# Altium schematic sheet PWRsupply.SchDoc
size A
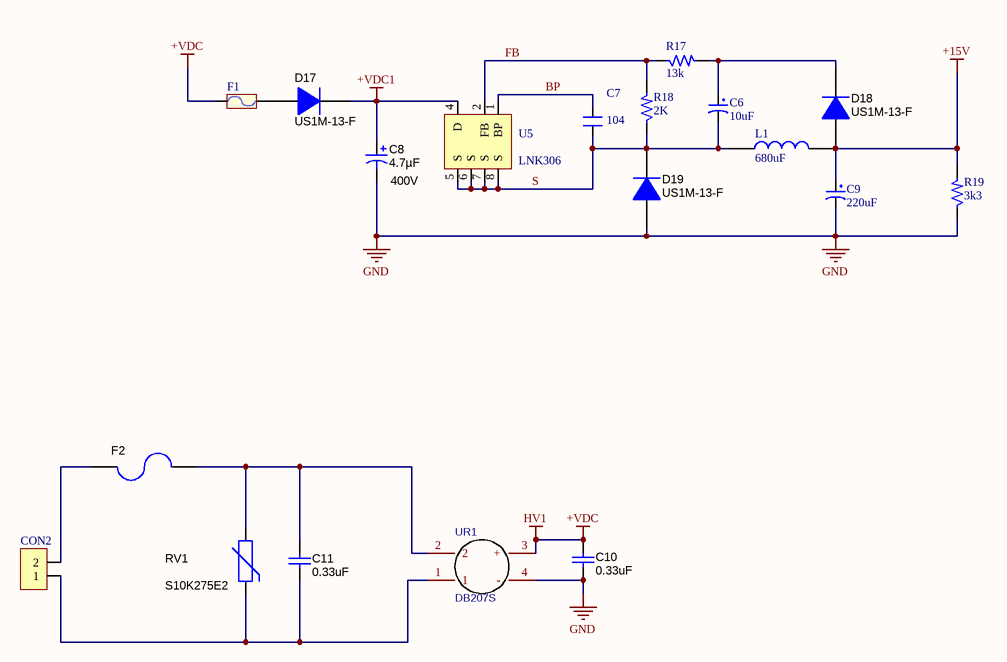
[diagram p0: PWRsupply.SchDoc]

## Parts
C6  10uF  [TU_NHOM_10uF_MH]
C7  104  [0805_Cap]
C8  ValueDisplayed: 4.7µF  Value2: 400V  [CAP-PANACAP-G-GENERIC]  (hidden comment: 400AX6R8M8x11)
C9  220uF  [TU_NHOM_2.5_MH]
C10  value 0.33uF  [B32922_12mm]  (hidden comment: B32922C3334M189)
C11  value 0.33uF  [B32922_12mm]  (hidden comment: B32922C3334M189)
CON2  CON 2 EDG 5.08_MH  [CON 2 EDG 5.08]  (value not drawn)
D17  US1M-13-F  [SMB]
D18  US1M-13-F  [SMB]
D19  US1M-13-F  [SMB]
F1  FUSE_AUTO_0.5A 8V 1206_MH  [FUSE 1206]  (value not drawn)
F2  37015000430  [Fuse 5x20]  (value not drawn)
L1  680uF  [Inductor 4.5x5]
R17  13k  [0805_R]
R18  2K  [0805_R]
R19  3k3  [0805_R]
RV1  S10K275E2  [VAR_S10K275E2]
U5  LNK306  [SOP 7]
UR1  DB207S  [DB207S]

## Nets
+15V: C9.1 D18.2(A) L1.2 R19.2
+VDC: C10.2 F1.1 UR1.3(+)  [also labelled HV1]
+VDC1: C8.1(+) D17.1(K) U5.4(D)
GND: C8.2(-) C9.2 C10.1 D19.2(A) R19.1 UR1.4(-)
BP: C7.2 U5.1(BP)
FB: R17.1 R18.2 U5.2(FB)
S: C6.2 C7.1 D19.1(K) L1.1 R18.1 U5.5(S) U5.6(S) U5.7(S) U5.8(S)
NetC6_1: C6.1 D18.1(K) R17.2
NetC11_1: C11.1 CON2.1 RV1.2 UR1.1
NetC11_2: C11.2 F2.1 RV1.1 UR1.2
NetCON2_2: CON2.2 F2.2
NetD17_2: D17.2(A) F1.2

## Library data of the parts
C6 = TU_NHOM_10uF_25V_MH: Value: 47uF/16 - 50V; Description 1: 470uF/6,3V - 330uF/10V - 220uF/16V; Description 2: 100uF/25V - 35V - 47uF/50V - 22uF/100V; Description 3: 33uF => 47uF/63V - 1uF => 4,7uF/160V; Description 4: 1uF => 2,2uF/250V - 1uF/350V
C7 = CM: Cap SMD; Value: 103
C8 = 400AX6R8M8x11: CAP, AL, 6.8uF, 400V, +/-20%, TH; Manufacturer: Rubycon; Polarized: Y; CompType: Capacitor; U/M: EA; Cap_F: 0.0000068; Tolerance_%: 20; Value1: Unknown; VDC_V: 400; TaMin_C: -40; TaMax_C: 105; Cap_Case: 8x11; SymbolVersion: 2008-07-09; Value: 6.8uF; PartNumber: 400AX6R8M8x11; PackageReference: 8x11; RoHS: Y; MountType: TH; Technology: AL; Series: AX; Publisher: Texas Instruments; LatestRevisionDate: 2013-08-02; ComponentLink1Description: Datasheet link; ComponentLink1URL: http://www.rubycon.co.jp/de/catalog/e_pdfs/aluminum/e_ax.pdf
C9 = TU_NHOM_220uF_25V_MH: LINK: https://item.taobao.com/item.htm?spm=a230r.1.14.282.6c612953FsebRk&id=546158429968&ns=1&abbucket=10#detail
C10 C11 = BFC233620154: CAP FILM 0.33UF 630VDC RADIAL; Manufacturer: EPCOS(TDK); CompType: Film Capacitor; SymbolCreator: x0199378; PartNumber: B32922C3334M189; RoHS: Y; MountType: TH; ComponentLink1Description: Datasheet link; ComponentLink1URL: http://en.tdk.eu/inf/20/20/db/fc_2009/X2_B32921_928.pdf; SymbolVersion: 2015-01-29
CON2 = CON 2 EDG 5.08_MH: CON 2 EDG 5.08 (xanh cong)
D17-D19 = MURS160-13-F: Diode, Ultrafast, 600V, 1A, SMB; Manufacturer: Diodes Inc.; U/M: EA; Vf_V: 1.25; Value2: 1.25V; Io_A: 1; Vr_V: 600; TJmax_C: 150; RJC_CperW: 13; PartNumber: US1M-13-F; CompType: Diode; SymbolVersion: 2008-12-08; MountType: SMT; RoHS: Y; Value: 600V; PackageReference: SMB; Value1: 1A; Type: Ultrafast; Published: 2008-06-26; Publisher: Texas Instruments; LatestRevisionDate: 2013-06-21; ComponentLink1Description: Datasheet link; ComponentLink1URL: http://www.diodes.com/datasheets/ds30130.pdf; Supplier 1: Digi-Key; Supplier 2: Mouser; Supplier 3: Farnell
F1 = FUSE_AUTO_0.5A 8V 1206_MH: Fuse
F2 = 0216008.MXESPP: FUSE BOARD MOUNT 5A 250VAC RAD; Manufacturer: Littelfuse Inc; U/M: EA; VDC_V: 250; Irating_A: 5; Rtyp_Ohm: 0.0123; Soldering_Wave_MaxTemp_C: 260; SymbolVersion: 2008-07-09; PartNumber: 37015000430; PackageReference: Radial, Can, Vertical; CompType: Fuse; Published: 2009-03-05; RoHS: Y; VAC_V: 250; Publisher: Texas Instruments; LatestRevisionDate: 2014-04-17; ComponentLink1Description: Datasheet link; ComponentLink1URL: http://www.littelfuse.com/~/media/electronics/datasheets/fuses/littelfuse_fuse_370_datasheet.pdf.pdf; Soldering_Wave_MaxTime_s: 5; MountType: TH; Supplier 1: Digi-Key; Supplier Part Number 1: F4482-ND
L1 = Inductor 4.5x5_MH
R17-R19 = R: Resistor 1/4W; Value: R1/4W - 1K
RV1 = S10K275E2: Varistor 275V RMS 10MM Radial, TH; Manufacturer: EPCOS Inc; SymbolCreator: a0412235; SymbolVersion: 2012-06-04; PartNumber: S10K275E2; MountType: TH; ComponentLink1Description: Datasheet URL; ComponentLink1URL: http://www.epcos.com/inf/70/db/var_08/SIOV_Leaded_AdvanceD.pdf; RoHS: Y; PackageReference: 10mm Radial; Publisher: Texas Instruments; LatestRevisionDate: 2013-02-24; Supplier 1: Digi-Key; Supplier Part Number 1: 495-1433-ND
U5 = Component_1
UR1 = DB207S: BOM_Manufacturer: DYELEC; SMT Type: Extend; BOM_Supplier: LCSC; BOM_Manufacturer Part: DB207S; image: //image.lceda.cn/szlcsc/C84160.jpg; BOM_Supplier Part: C84160; BOM_LCSC Assembly: Yes; spicePre: U